# Altium schematic sheet Power.SchDoc
size A4
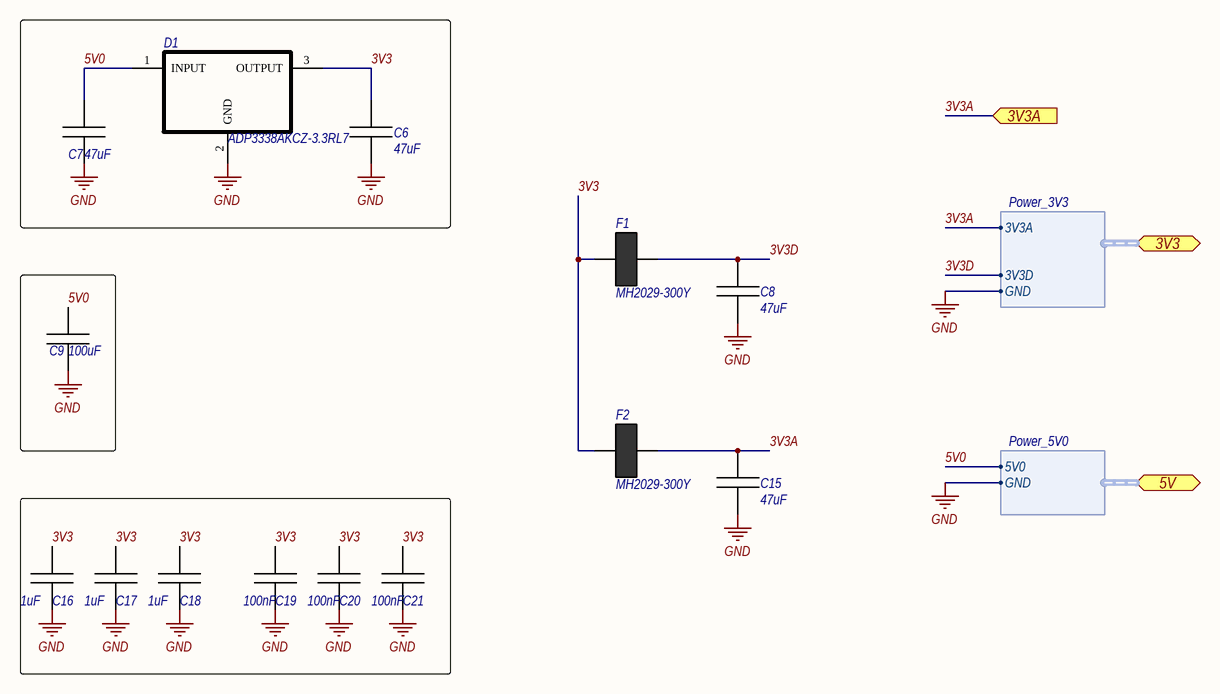
[diagram p0: Power.SchDoc]

## Parts
C6  47uF
C7  47uF
C8  47uF
C9  100uF
C15  47uF
C16  1uF
C17  1uF
C18  1uF
C19  100nF
C20  100nF
C21  100nF
D1  ADP3338AKCZ-3.3RL7
F1  MH2029-300Y
F2  MH2029-300Y

## Ports
3V3 (harness Power_3V3), 3V3A, 5V (harness Power_5V0)

## Harnesses
Power_5V0: 5V0, GND
Power_3V3: 3V3A, GND, 3V3D

## Nets
GND: C6.1 C7.1 C8.1 C9.1 C15.1 C16.1 C17.1 C18.1 C19.1 C20.1 C21.1 D1.2(GND) ; port 5V.GND, port 3V3.GND
3V3: C6.2 C16.2 C17.2 C18.2 C19.2 C20.2 C21.2 D1.3(OUTPUT) F1.1 F2.1
3V3A: C15.2 F2.2 ; port 3V3A, port 3V3.3V3A
3V3D: C8.2 F1.2 ; port 3V3.3V3D
5V0: C7.2 C9.2 D1.1(INPUT) ; port 5V.5V0

## Library data of the parts
C6-C9 C15-C21 = Capacitor
D1 = ADP3338AKCZ-3.3RL7: LDO
F1 F2 = Ferrite